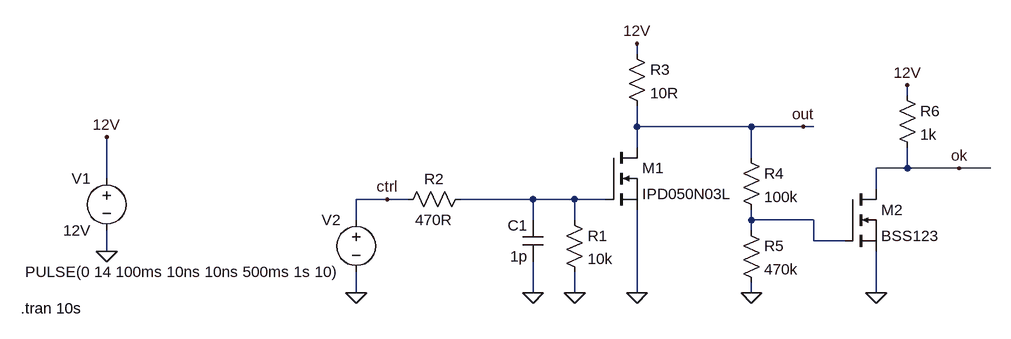
[diagram p0: schematic OpenLoad.asc]
OpenLoad.asc, the LTspice schematic file:
Version 4
SHEET 1 1588 680
WIRE 1040 -48 1040 -64
WIRE 1456 16 1456 0
WIRE 1040 64 1040 32
WIRE 1216 64 1040 64
WIRE 1296 64 1216 64
WIRE 1312 64 1296 64
WIRE 1040 96 1040 64
WIRE 1216 112 1216 64
WIRE 1456 128 1456 96
WIRE 1456 128 1408 128
WIRE 1536 128 1456 128
WIRE 1584 128 1536 128
WIRE 224 144 224 80
WIRE 1408 160 1408 128
WIRE 656 176 608 176
WIRE 688 176 656 176
WIRE 880 176 768 176
WIRE 944 176 880 176
WIRE 992 176 944 176
WIRE 608 208 608 176
WIRE 880 208 880 176
WIRE 944 208 944 176
WIRE 1216 208 1216 192
WIRE 1312 208 1216 208
WIRE 1216 224 1216 208
WIRE 1312 240 1312 208
WIRE 1360 240 1312 240
WIRE 224 256 224 224
WIRE 608 320 608 288
WIRE 880 320 880 272
WIRE 944 320 944 288
WIRE 1040 320 1040 192
WIRE 1216 320 1216 304
WIRE 1408 320 1408 256
FLAG 224 256 0
FLAG 224 80 12V
FLAG 880 320 0
FLAG 944 320 0
FLAG 1040 320 0
FLAG 608 320 0
FLAG 1040 -64 12V
FLAG 656 176 ctrl
FLAG 1296 64 out
FLAG 1216 320 0
FLAG 1408 320 0
FLAG 1536 128 ok
FLAG 1456 0 12V
SYMBOL voltage 224 128 M0
SYMATTR InstName V1
SYMATTR Value 12V
SYMBOL nmos 992 96 R0
SYMATTR InstName M1
SYMATTR Value IPD050N03L
SYMBOL res 928 192 R0
SYMATTR InstName R1
SYMATTR Value 10k
SYMBOL res 784 160 R90
WINDOW 0 0 56 VBottom 2
WINDOW 3 32 56 VTop 2
SYMATTR InstName R2
SYMATTR Value 470R
SYMBOL cap 896 208 M0
SYMATTR InstName C1
SYMATTR Value 1p
SYMBOL voltage 608 192 M0
WINDOW 123 0 0 Left 2
WINDOW 39 0 0 Left 2
SYMATTR InstName V2
SYMATTR Value PULSE(0 14 100ms 10ns 10ns 500ms 1s 10)
SYMBOL res 1024 -64 R0
SYMATTR InstName R3
SYMATTR Value 10R
SYMBOL res 1200 96 R0
SYMATTR InstName R4
SYMATTR Value 100k
SYMBOL res 1200 208 R0
SYMATTR InstName R5
SYMATTR Value 470k
SYMBOL nmos 1360 160 R0
SYMATTR InstName M2
SYMATTR Value BSS123
SYMBOL res 1440 0 R0
SYMATTR InstName R6
SYMATTR Value 1k
TEXT 92 344 Left 2 !.tran 10s

The netlist it stands for:
* OpenLoad.asc
V1 12V 0 12V
M1 out N001 0 0 IPD050N03L
R1 N001 0 10k
R2 N001 ctrl 470R
C1 N001 0 1p
V2 ctrl 0 PULSE(0 14 100ms 10ns 10ns 500ms 1s 10)
R3 12V out 10R
R4 out N002 100k
R5 N002 0 470k
M2 ok N002 0 0 BSS123
R6 12V ok 1k
.model NMOS NMOS
.model PMOS PMOS
.lib standard.mos
.tran 10s
.backanno
.end